# EAGLE design NixieDriverPower (EAGLE 7.1.0)
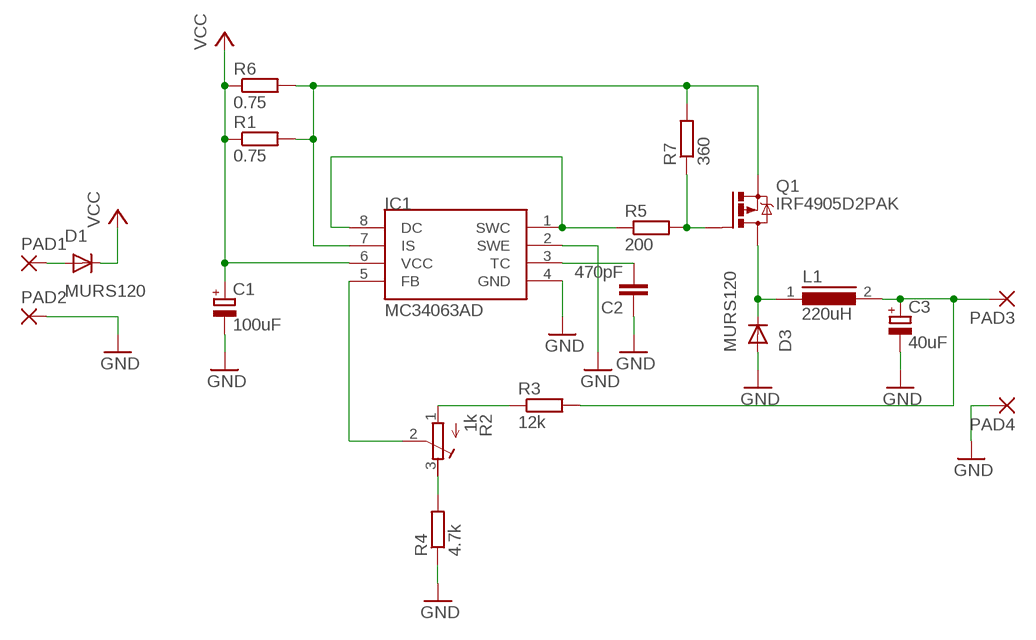
[diagram p0: schematic, sheet 1]

## Parts
C1  100uF  CPOL-EUD/7343-31R  [D/7343-31R]
C2  470pF  C-EUC1206K  [C1206K]
C3  40uF  CPOL-EUC/6032-28R  [C/6032-28R]
D1  MURS120  DIODE-DO214AA  [DO214AA]
D3  MURS120  DIODE-DO214AA  [DO214AA]
IC1  MC34063AD  [SOIC8]
L1  220uH  DR125  [DR125]
PAD1  SMD5  [SMD2,54-5,08]
PAD2  SMD5  [SMD2,54-5,08]
PAD3  SMD5  [SMD2,54-5,08]
PAD4  SMD5  [SMD2,54-5,08]
Q1  IRF4905D2PAK  [D2PAK]
R1  0.75  R-EU_R1206  [R1206]
R2  1k  R-TRIMM4G/J  [RTRIM4G/J]
R3  12k  R-EU_R1206  [R1206]
R4  4.7k  R-EU_R1206  [R1206]
R5  200  R-EU_R1206  [R1206]
R6  0.75  R-EU_R1206  [R1206]
R7  360  R-EU_R1206  [R1206]

## Nets
GND: C1.- C2.1 C3.- D3.A IC1.2(SWE) IC1.4(GND) PAD2.1(P) PAD4.1(P) R4.1
N$1: D3.C L1.1 Q1.4(D)
N$2: C2.2 IC1.3(TC)
N$4: Q1.1(G) R5.2 R7.1
N$5: IC1.7(IS) Q1.3(S) R1.2 R6.2 R7.2
N$6: C3.+ L1.2 PAD3.1(P) R3.2
N$7: IC1.5(FB) R2.2(S)
N$8: R2.3(E) R4.2
N$9: R2.1(A) R3.1
N$10: IC1.1(SWC) IC1.8(DC) R5.1
N$12: D1.A PAD1.1(P)
VCC: C1.+ D1.C IC1.6(VCC) R1.1 R6.1

## Library data of the parts
C1 C3 = rcl:CPOL-EU: POLARIZED CAPACITOR, European symbol
C2 = rcl:C-EU: CAPACITOR, European symbol
D1 D3 = diode:DIODE-: DIODE
IC1 = mc34063:MC34063
L1 = inductors:DR125: High Power Density, High Efficiency, Shielded Inductors Source: coiltronics_dr_series.pdf
PAD1-PAD4 = wirepad:SMD5: SMD PAD
Q1 = own-collection:IRF4905: P-Channel HEXFET® Power MOSFET RDS(on)= 0.02 Ohm, ID = -74A Source: http://www.irf.com/product-info/datasheets/data/irf4905pbf.pdf
R1 R3-R7 = rcl-2:R-EU_: RESISTOR, European symbol
R2 = rcl:R-TRIMM: Trimm resistor

## Board
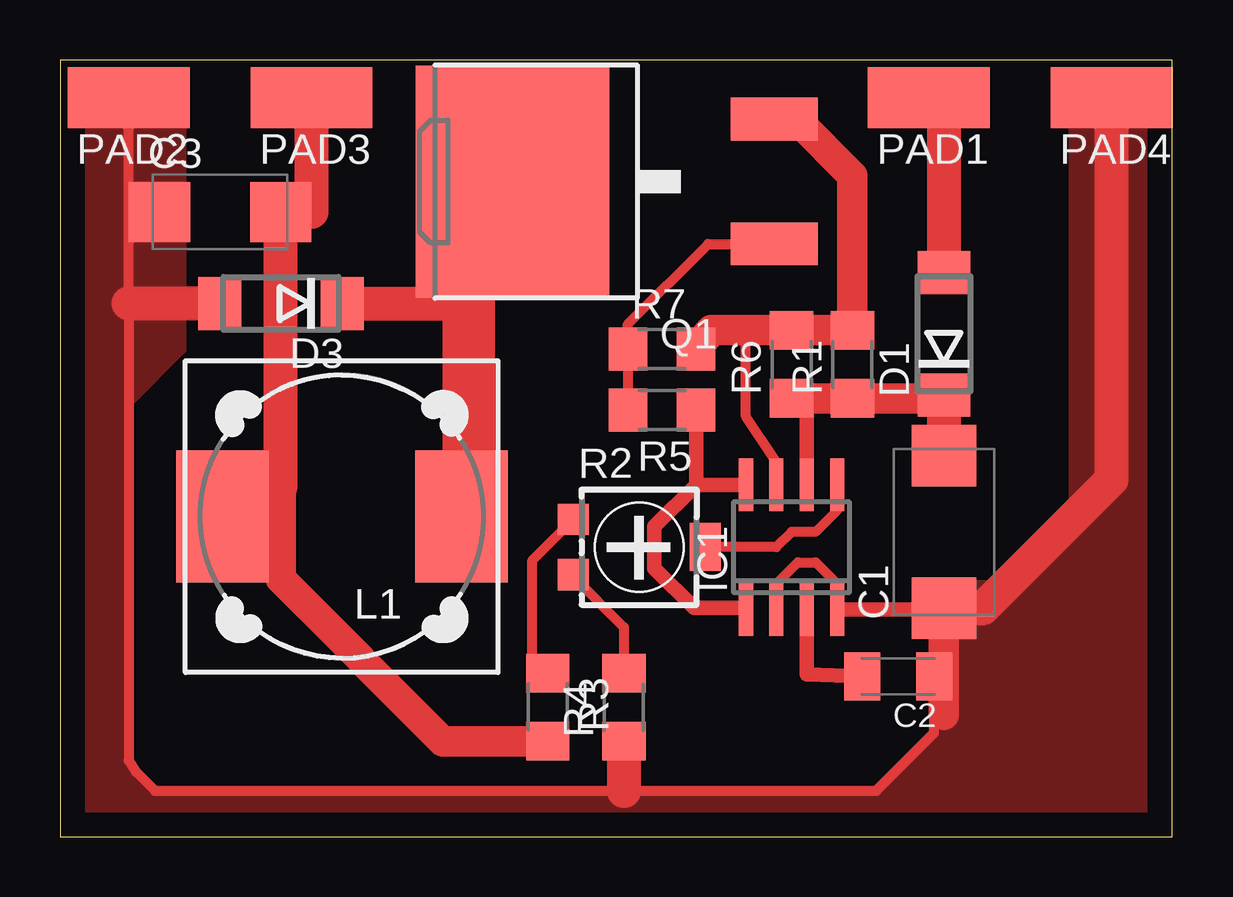
[diagram p1: board, top side]

Size 46.34 x 32.38 mm. Coordinates in mm from the lower left corner, seen from the top.
Outline: 0,0 46.34,0 46.34,32.38 0,32.38 0,0
Copper layers (1*16): Top 0.035mm / dielectric 1.5mm / Bottom 0.035mm
Design rules "default": minimum track width 10mil, minimum drill 24mil, track to track 8mil, track to pad 8mil, pad to pad 8mil, via to via 8mil, smd to smd 8mil, copper to edge 40mil, drill to drill 8mil, minimum pad ring 10mil, minimum via ring 8mil, stop-mask expansion 4mil, vias tented up to drill 0mil, thermal gap 10mil

### Footprints (pad centres in the part's own frame; a part is rotated, then mirrored left to right if it is on the bottom)
D/7343-31R = smd 2.55 x 2.7: + 3.175,0; - -3.175,0
C1206K = smd 1.5 x 2: 1 -1.5,0; 2 1.5,0
C/6032-28R = smd 2.55 x 2.5: + 2.525,0; - -2.525,0
DO214AA = smd 1.8 x 2.2: A 2.55,0; C -2.55,0
SOIC8 = smd 0.6 x 2.2: 1 -1.905,-2.6; 2 -0.635,-2.6; 3 0.635,-2.6; 4 1.905,-2.6; 5 1.905,2.6; 6 0.635,2.6; 7 -0.635,2.6; 8 -1.905,2.6
DR125 = smd 3.85 x 5.5: 1 -4.975,0; 2 4.975,0
SMD2,54-5,08 = smd 2.54 x 5.08: 1 0,0
D2PAK = smd 1.78 x 3.635: 1 -2.598,-5.31; 3 2.598,-5.31 | smd 9.652 x 8.066: 4 0,5.588
R1206 = smd 1.6 x 1.803: 1 -1.422,0; 2 1.422,0
RTRIM4G/J = smd 1.3 x 1.3: 1 -1.15,-2.75; 3 1.15,-2.75 | smd 2 x 1.3: 2 0,2.75

### Placement (x,y rotation side)
C1  36.83,12.7 90 top
C2  34.92,6.67 180 top
C3  6.67,26.04 0 top
D1  36.83,20.95 90 top
D3  9.21,22.23 180 top
IC1  30.48,12.06 0 top
L1  11.75,13.34 180 top
PAD1  36.2,30.8 90 top
PAD2  2.86,30.8 90 top
PAD3  10.48,30.8 90 top
PAD4  43.81,30.8 90 top
Q1  24.45,27.3 90 top
R1  33.02,19.68 90 top
R2  24.13,12.06 270 top
R3  20.32,5.4 270 top
R4  23.5,5.4 90 top
R5  25.08,17.78 180 top
R6  30.48,19.68 90 top
R7  25.08,20.32 0 top

### Tracks (layer width: path | path; a pad name or v marks a point on that pad's centre or on a via)
GND
  Top 0.406: 36.83,9.46 C1.- | 36.83,5.08 C2.1 36.42,4.32 34.01,1.91 23.5,1.91 3.96,1.91 3.17,2.69 2.86,3.17 2.86,22.23 2.86,26.04 | IC1.2 29.84,10.53 30.74,11.43 31.49,11.43 32.38,10.53 IC1.4 | 2.86,26.04 PAD2.1 | C3.- 2.86,26.04
  Top 0.61: IC1.4 36.83,9.46
  Top 1.27: 36.83,5.08 C1.-
  Top 1.422: C1.- 38.46,9.53 43.81,14.88 PAD4.1 | D3.A 2.86,22.23 | R4.1 23.5,1.91
  pour Top (no thermals): 5.08,32.38 0,32.38 0,0 46.35,0 46.35,31.75 42.23,31.75 42.23,13.97 38.73,10.48 36.51,10.48 36.51,4.45 33.97,1.91 3.81,1.91 2.86,2.86 2.86,18.1 5.08,20.32
N$1
  Top 0.406: Q1.4 18.95,27.3 | 19.05,27.3 Q1.4 | 17.04,27.3 Q1.4
  Top 1.422: D3.C 17.04,22.23
  Top 2.184: L1.1 16.51,13.34 17.04,13.87 17.04,22.23 17.04,27.3
N$2
  Top 0.61: C2.2 31.11,6.75 IC1.3
N$4
  Top 0.406: R5.2 R7.1 23.66,21.36 27,24.71 Q1.1
N$5
  Top 0.406: 30.63,21.42 31.11,21.11 | IC1.7 29.84,15.61 28.57,17.52 28.57,21.11 | 30.07,29.84 Q1.3
  Top 1.27: 30.07,29.84 30.73,29.84 33.02,27.55 R1.2 31.11,21.11 R6.2 28.57,21.11 27.14,21.11 R7.2
N$6
  Top 0.406: 8.99,26.04 C3.+ 9.95,26.04
  Top 1.27: R3.2 15.95,3.98 9.19,10.73 9.19,14.61
  Top 1.422: PAD3.1 10.48,26.04 C3.+ 9.19,14.61 L1.2
N$7
  Top 0.406: IC1.5 32.38,13.6 31.49,12.7 30.48,12.7 29.84,12.06 R2.2
N$8
  Top 0.406: R2.3 21.38,10.84 23.5,8.72 R4.2
N$9
  Top 0.406: R3.1 19.68,6.82 19.68,11.52 R2.1
N$10
  Top 0.406: IC1.1 28.57,9.53
  Top 0.61: R5.1 26.5,14.66 | 26.5,14.66 IC1.8 | 28.57,9.53 26.42,9.53 24.77,11.18 24.77,12.93 26.5,14.66
N$12
  Top 1.422: PAD1.1 36.83,30.48 D1.A
VCC
  Top 0.61: 31.11,18.26 IC1.6
  Top 1.27: R6.1 31.11,18.26 R1.1 36.83,18.26
  Top 1.422: D1.C 36.83,18.26 C1.+